# Altium project PCB_Project.PrjPcb
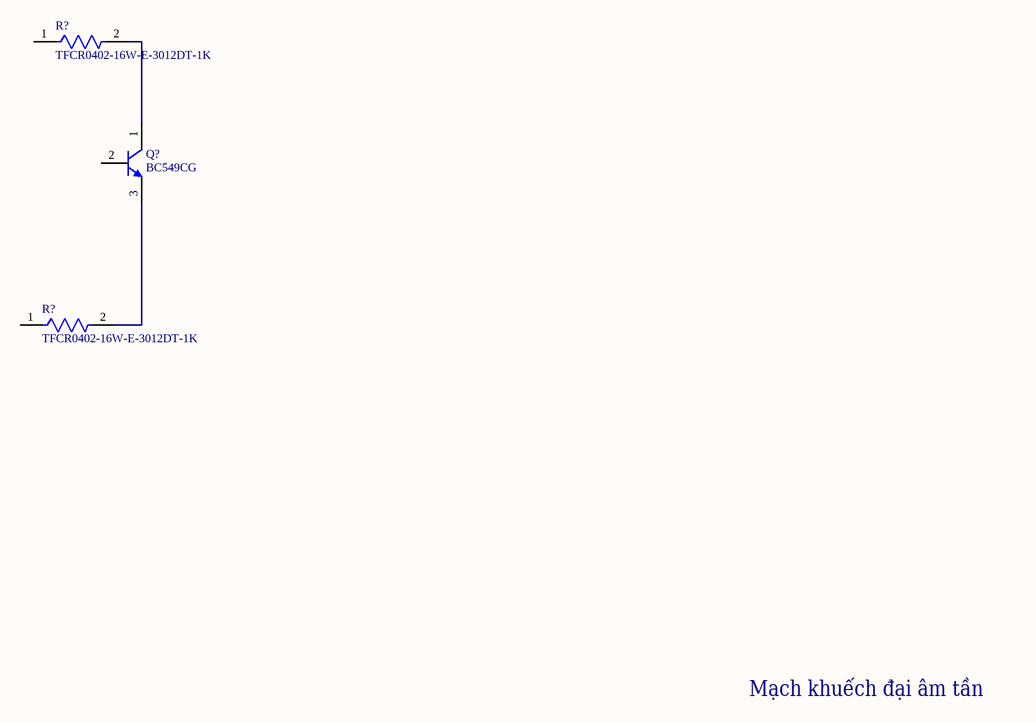
[diagram p0: Sheet1.SchDoc]
1 sheet, 3 parts. Net scope: global (net labels, ports and power ports of the same name join across sheets).
Board file: PCB1.PcbDoc

## Sheet Sheet1.SchDoc
size A4; SheetNumber: 1; SheetTotal: 1

### Parts
(Parts that share a designator on the sheet are numbered #1, #2 ... from top to bottom, then left to right.)
Q?  BC549CG  [ONSC-TO-92-3-29-04_AD]
R?#1  TFCR0402-16W-E-3012DT-1K  [FP-TFCR0402-IPC_A]
R?#2  TFCR0402-16W-E-3012DT-1K  [FP-TFCR0402-IPC_A]

### Nets
NetQ?_1: Q?.1(C) R?#1.2
NetQ?_3: Q?.3(E) R?#2.2

Not connected (* = marked no-connect by the designer): Q? 2(B); R?#1 1; R?#2 1

### Notes on the sheet
- Mạch khuếch đại âm tần

### Library data of the parts
Q? = CMP-1048-01363-1: Low Noise Transistor, NPN Silicon, 3-Pin TO-92, Pb-Free, Bulk Box; Manufacturer: On Semiconductor; IC Continuous (A): 0.1; RoHS: TRUE; Mounting Technology: Through Hole; ComponentLink3URL: http://www.onsemi.com/pub_link/Collateral/BC549B-D.PDF; PackageDescription: 3-Pin Transistor Outline, Body 4.825 x 3.685 mm, Pitch 1.27 mm; DatasheetVersion: Rev. AD; ComponentLink3Description: Package Specification; ComponentLink1URL: http://www.onsemi.com/; PackageVersion: Rev. AD; PartNumber: BC549CG; Polarity: NPN; ComponentLink2Description: Datasheet; ComponentLink1Description: Manufacturer URL; Packing: Bulk Box; ComponentLink2URL: http://www.onsemi.com/pub_link/Collateral/BC549B-D.PDF; PackageReference: TO-92-3-29-04_AD
R?#1 R?#2 = CMP-250906-218364-1: RES Thin Film,  30.1kΩ, 0.5%, 0.063W, 25ppm/°C, 0402